# EAGLE schematic uBlox GPS Cape (EAGLE 7.1.0)

## Sheet 1 of 2
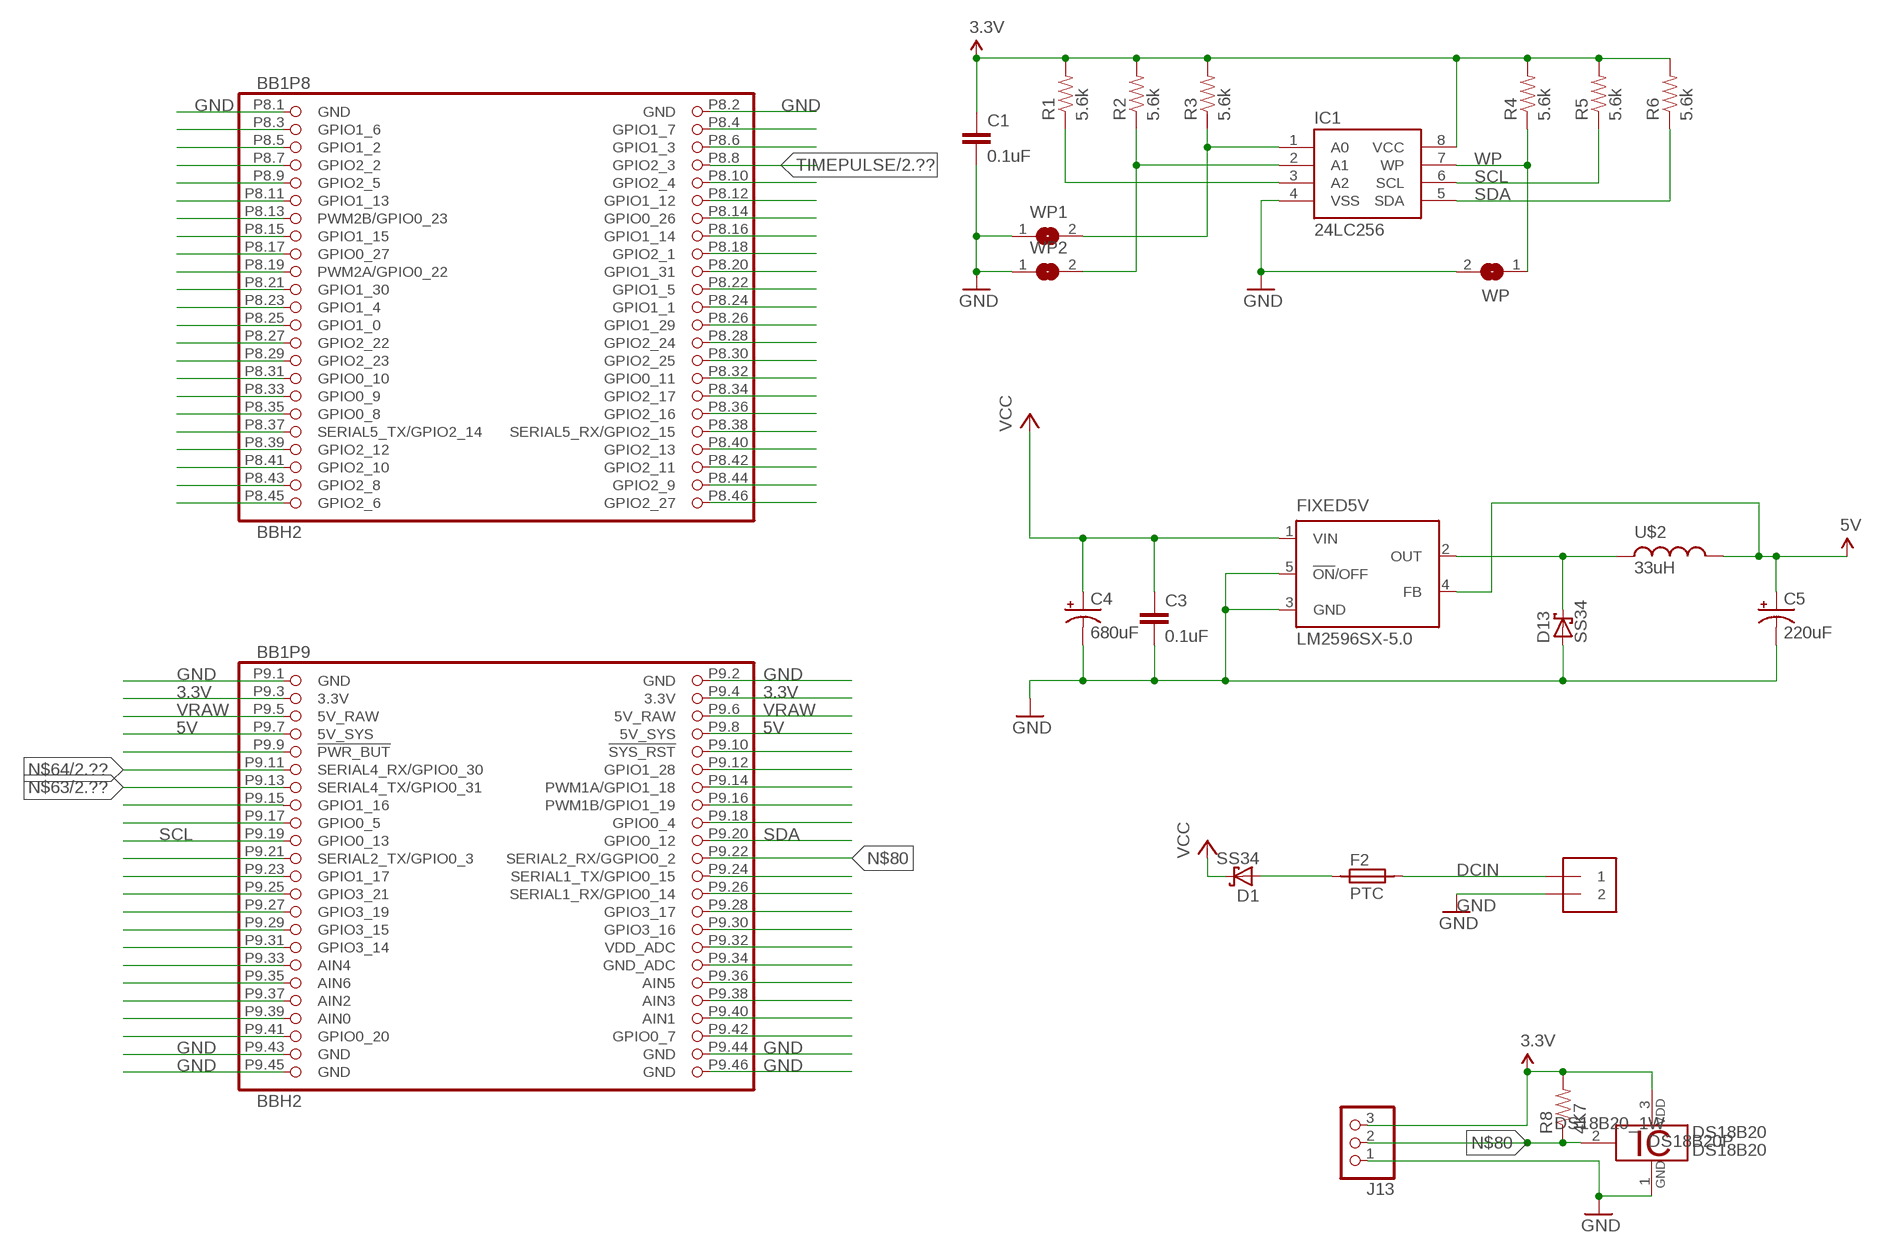
[diagram p0: schematic, sheet 1]

### Parts
BB1  BBH2  [BB_CAPE_TOP]
C1  0.1uF  CAP0603-CAP  [0603-CAP]
C3  0.1uF  CAP0603-CAP  [0603-CAP]
C4  680uF  CAP_POLH13  [PANASONIC_H13]
C5  220uF  CPOL-US153CLV-0810  [153CLV-0810]
D1  SS34  SCHOTTKY-DIODESMC  [SMC]
D13  SS34  SCHOTTKY-DIODESMC  [SMC]
DS18B20  DS18B20  [TO92-]
F2  PTC  SIBA194700A300L  [2920]
FIXED5V  LM2596SX-5.0  LM2596S  [TO263-5]
IC1  24LC256  EEPROM-I2CSMD  [SO08]
J1  1X2-3.5MM  [1X2-3.5MM]
J13  HEADER_1X3  [HEADER_1X3]
R1  5.6k  RESISTOR0603-RES  [0603-RES]
R2  5.6k  RESISTOR0603-RES  [0603-RES]
R3  5.6k  RESISTOR0603-RES  [0603-RES]
R4  5.6k  RESISTOR0603-RES  [0603-RES]
R5  5.6k  RESISTOR0603-RES  [0603-RES]
R6  5.6k  RESISTOR0603-RES  [0603-RES]
R8  4K7  RESISTOR0805-RES  [0805]
U$2  33uH  MSS1260  [MSS1260]
WP  SJH  [SJ]
WP1  SJH  [SJ]
WP2  SJH  [SJ]

### Nets
3.3V: BB1.P9.3(P9:3.3V) BB1.P9.4(P9:3.3V) C1.1 DS18B20.3 IC1.8(VCC) J13.3 R1.2 R2.2 R3.2 R4.2 R5.2 R6.2 R8.2 ; also sheet 2
5V: BB1.P9.7(P9:5V_SYS) BB1.P9.8(P9:5V_SYS)
DCIN: F2.2 J1.1
GND [gnd]: BB1.P8.1(P8:GND) BB1.P8.2(P8:GND) BB1.P9.1(P9:GND) BB1.P9.2(P9:GND) BB1.P9.43(P9:GND) BB1.P9.44(P9:GND) BB1.P9.45(P9:GND) BB1.P9.46(P9:GND) C1.2 C3.2 C4.- C5.- D13.A DS18B20.1 FIXED5V.3(GND) FIXED5V.5(!ON!/OFF) IC1.4(VSS) J1.2 J13.1 WP1.1 WP2.1 WP.2 ; also sheet 2
N$3: BB1.P8.4(P8:GPIO1_7)
N$4: BB1.P8.6(P8:GPIO1_3)
N$6: BB1.P8.10(P8:GPIO2_4)
N$7: BB1.P8.12(P8:GPIO1_12)
N$8: BB1.P8.14(P8:GPIO0_26)
N$9: BB1.P8.16(P8:GPIO1_14)
N$10: BB1.P8.18(P8:GPIO2_1)
N$11: BB1.P8.20(P8:GPIO1_31)
N$12: BB1.P8.22(P8:GPIO1_5)
N$13: BB1.P8.24(P8:GPIO1_1)
N$14: BB1.P8.26(P8:GPIO1_29)
N$15: BB1.P8.28(P8:GPIO2_24)
N$16: BB1.P8.30(P8:GPIO2_25)
N$17: BB1.P8.32(P8:GPIO0_11)
N$18: BB1.P8.34(P8:GPIO2_17)
N$19: BB1.P8.36(P8:GPIO2_16)
N$20: BB1.P8.38(P8:SERIAL5_RX/GPIO2_15)
N$21: BB1.P8.40(P8:GPIO2_13)
N$22: BB1.P8.42(P8:GPIO2_11)
N$23: BB1.P8.44(P8:GPIO2_9)
N$24: BB1.P8.45(P8:GPIO2_6)
N$25: BB1.P8.43(P8:GPIO2_8)
N$26: BB1.P8.41(P8:GPIO2_10)
N$27: BB1.P8.39(P8:GPIO2_12)
N$28: BB1.P8.37(P8:SERIAL5_TX/GPIO2_14)
N$29: BB1.P8.35(P8:GPIO0_8)
N$30: BB1.P8.33(P8:GPIO0_9)
N$31: BB1.P8.31(P8:GPIO0_10)
N$32: BB1.P8.29(P8:GPIO2_23)
N$33: BB1.P8.27(P8:GPIO2_22)
N$34: BB1.P8.25(P8:GPIO1_0)
N$35: BB1.P8.23(P8:GPIO1_4)
N$36: BB1.P8.21(P8:GPIO1_30)
N$37: BB1.P8.19(P8:PWM2A/GPIO0_22)
N$38: BB1.P8.17(P8:GPIO0_27)
N$39: BB1.P8.15(P8:GPIO1_15)
N$40: BB1.P8.13(P8:PWM2B/GPIO0_23)
N$41: BB1.P8.11(P8:GPIO1_13)
N$42: BB1.P8.9(P8:GPIO2_5)
N$43: BB1.P8.7(P8:GPIO2_2)
N$44: BB1.P8.5(P8:GPIO1_2)
N$45: BB1.P8.3(P8:GPIO1_6)
N$46: BB1.P8.46(P8:GPIO2_27)
N$49: BB1.P9.41(P9:GPIO0_20)
N$50: BB1.P9.39(P9:AIN0)
N$51: BB1.P9.37(P9:AIN2)
N$52: BB1.P9.35(P9:AIN6)
N$53: BB1.P9.33(P9:AIN4)
N$54: BB1.P9.31(P9:GPIO3_14)
N$55: BB1.P9.29(P9:GPIO3_15)
N$56: BB1.P9.27(P9:GPIO3_19)
N$57: BB1.P9.25(P9:GPIO3_21)
N$58: BB1.P9.23(P9:GPIO1_17)
N$59: BB1.P9.21(P9:SERIAL2_TX/GPIO0_3)
N$61: BB1.P9.17(P9:GPIO0_5)
N$62: BB1.P9.15(P9:GPIO1_16)
N$63: BB1.P9.13(P9:SERIAL4_TX/GPIO0_31) ; also sheet 2
N$64: BB1.P9.11(P9:SERIAL4_RX/GPIO0_30) ; also sheet 2
N$65: BB1.P9.9(P9:!PWR_BUT)
N$74: BB1.P9.10(P9:!SYS_RST)
N$75: BB1.P9.12(P9:GPIO1_28)
N$76: BB1.P9.14(P9:PWM1A/GPIO1_18)
N$77: BB1.P9.16(P9:PWM1B/GPIO1_19)
N$78: BB1.P9.18(P9:GPIO0_4)
N$80: BB1.P9.22(P9:SERIAL2_RX/GGPIO0_2) DS18B20.2 J13.2 R8.1
N$81: BB1.P9.24(P9:SERIAL1_TX/GPIO0_15)
N$82: BB1.P9.26(P9:SERIAL1_RX/GPIO0_14)
N$83: BB1.P9.28(P9:GPIO3_17)
N$84: BB1.P9.30(P9:GPIO3_16)
N$85: BB1.P9.32(P9:VDD_ADC)
N$86: BB1.P9.34(P9:GND_ADC)
N$87: BB1.P9.36(P9:AIN5)
N$88: BB1.P9.38(P9:AIN3)
N$89: BB1.P9.40(P9:AIN1)
N$90: BB1.P9.42(P9:GPIO0_7)
N$96: D13.C FIXED5V.2(OUT) U$2.P$2
N$97: D1.A F2.1
N$232: IC1.1(A0) R3.1 WP1.2
N$233: IC1.2(A1) R2.1 WP2.2
N$234: IC1.3(A2) R1.1
SCL: BB1.P9.19(P9:GPIO0_13) IC1.6(SCL) R5.1
SDA: BB1.P9.20(P9:GPIO0_12) IC1.5(SDA) R6.1
TIMEPULSE: BB1.P8.8(P8:GPIO2_3) ; also sheet 2
VCC: C3.1 C4.+ D1.C FIXED5V.1(VIN)
VRAW: BB1.P9.5(P9:5V_RAW) BB1.P9.6(P9:5V_RAW) C5.+ FIXED5V.4(FB) U$2.P$1 ; supply symbol labelled 5V
WP: IC1.7(WP) R4.1 WP.1

## Sheet 2 of 2
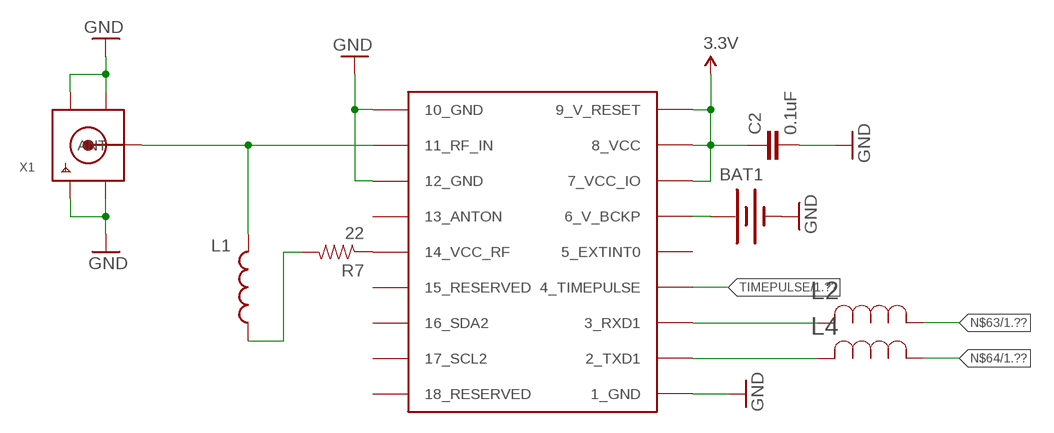
[diagram p1: schematic, sheet 2]

### Parts
BAT1  BATTERY12MM  [BATTCON_12MM]
C2  0.1uF  CAP0603-CAP  [0603-CAP]
L1  INDUCTOR0603  [0603]
L2  BLM18HG102SN1D  [IND_BLM18_0603]
L4  BLM18HG102SN1D  [IND_BLM18_0603]
R7  22  RESISTOR0603-RES  [0603-RES]
U$1  UBLOX_MAX  [UBLOX_MAX]
X1  SMACONNECTOR_EDGE_UFL  [SMA_EDGELAUNCH_UFL]

### Nets
3.3V: C2.1 U$1.7_VCC_IO U$1.8_VCC U$1.9_V_RESET ; also sheet 1
GND [gnd]: BAT1.GND(-) C2.2 U$1.1_GND U$1.10_GND U$1.12_GND X1.GND@1(GND1) X1.GND@2(GND2) X1.GND@3(GND3) X1.GND@4(GND4) ; also sheet 1
N$63: L2.1 ; also sheet 1
N$64: L4.1 ; also sheet 1
N$235: R7.1 U$1.14_VCC_RF
N$375: L1.2 R7.2
N$377: BAT1.PWR@1(+) U$1.6_V_BCKP
N$382: L2.2 U$1.3_RXD1
N$386: L4.2 U$1.2_TXD1
RF: L1.1 U$1.11_RF_IN X1.P(ANT)
TIMEPULSE: U$1.4_TIMEPULSE ; also sheet 1
Unconnected: U$1.5_EXTINT0 U$1.13_ANTON U$1.15_RESERVED U$1.16_SDA2 U$1.17_SCL2 U$1.18_RESERVED

## Library data of the parts
BAT1 = SparkFun-Electromechanical:BATTERY: Battery Holders Various common sizes : AA, AAA, 20mm coin cell and 12mm coin cell. 20MM_4LEGS, BATT-10373; MPN: BK-890
BB1 = logic-supply:BBH: BeagleBone header sub-assembly BBH1 outdated, use BBH2 or BBH3 only
C1 = SparkFun-Capacitors:CAP: Capacitor Standard 0603 ceramic capacitor, and 0.1" leaded capacitor.
C2 = SparkFun-Capacitors:CAP: Capacitor Standard 0603 ceramic capacitor, and 0.1" leaded capacitor.; MPN: CC0805KRX7R9BB104
C3 = SparkFun:CAP: Capacitor Standard 0603 ceramic capacitor, and 0.1" leaded capacitor.
C4 = SparkFun-Capacitors:CAP_POL: Capacitor Polarized These are standard SMD and PTH capacitors. Normally 10uF, 47uF, and 100uF in electrolytic and tantalum varieties. Always verify the external diameter of the through hole cap, it varies with capacity, voltage, and manufacturer. The EIA devices should be standard.
C5 = rcl:CPOL-US: POLARIZED CAPACITOR, American symbol
D1 D13 = diode:SCHOTTKY-DIODE: Schottky Diode
DS18B20 = 1wire:DS18B20: Programmable Resolution Digital Thermometer This chip provides a onewire thermosensor with approx. 0.5°C accuracy. A programmable over/undertemperure alarm is available. The precision can be set from 9..12 bits. Notes: Vdd must be applied for accurate measurements at low temperatures, as the parasite power circuit otherwise heats the sensor. If parasite power is used, Vdd has to be connected to GND. The DS1822 is a low-cost thermometer chip, the DS18S20 is similar to the DS18B20, but with 9 Bit precision only. Author: Jan Kandziora <jjj@gmx.de>
F2 = _hhn_PtcFuses_Siba_r500:SIBA194700*: SIBA PTC-Fuses, Series 194700, 2920 (7.5 5.5)mm Source: www.siba.de/ Package: SMD 2920 (7.5 x 5.5)mm Technologies: SIBA194600Axxx xxx: Trip-Current * 10 mA Author: Dipl.-Ing. FH Rainer Bayer
FIXED5V = national-semiconductor:LM2596: SIMPLE SWITCHER® Power Converter 150 kHz 3A Step-Down Voltage Regulator Source: http://www.national.com/ds/LM/LM2596.pdf; MF: NATIONAL SEMICONDUCTOR; MPN: LM2596S-ADJ/NOPB; OC_FARNELL: 9494367; OC_NEWARK: 41K3842
IC1 = logic-supply:EEPROM-I2C: I2C EEPROM chips, 24LC256 (and others)
J1 = adafruit:1X2: 3.5mm Terminal block http://www.ladyada.net/library/pcb/eaglelibrary.html
J13 = logic-supply:HEADER_1X3
L1 = SparkFun-Passives:INDUCTOR: Inductors Basic Inductor/Choke - 0603 and 1206. Footprints are not proven and vary greatly between part numbers. SRN6045- 33uH, 20% 1.4A SDR0403-560KL - 56uH, 10%, 500mA RMS/740mA peak; MPN: LBR2012T220K
L2 L4 = wrea:BLM18HG102SN1D; MANUFACTURER_PART_NUMBER: BLM18HG102SN1D; MPN: BLM18HG102SN1D; VENDOR: MURATA
R1-R6 = SparkFun:RESISTOR: Resistor
R7 = SparkFun-Resistors:RESISTOR: Resistor; MPN: RMCF0805JT22R0
R8 = SparkFun-Resistors:RESISTOR: Resistor
U$1 = ava:UBLOX_MAX: UBLOX MAX; MPN: MAX-7Q
U$2 = inductor-coilcraft:MSS1260: SMT Power Inductor
WP WP1 WP2 = Jumper Solder:SJ: SMD solder JUMPER
X1 = adafruit:SMACONNECTOR: SMA Connector 90° DIP SMA Connector, 50 Ohm (4UConnector: 07259)

## Net classes
0 default: width 0.152 mm, drill 0.406 mm, clearance 0.152 mm
2 gnd: width 0.152 mm, drill 0.406 mm, clearance 0.203 mm
5 3.3v: width 0.152 mm, drill 0.406 mm, clearance 0.152 mm